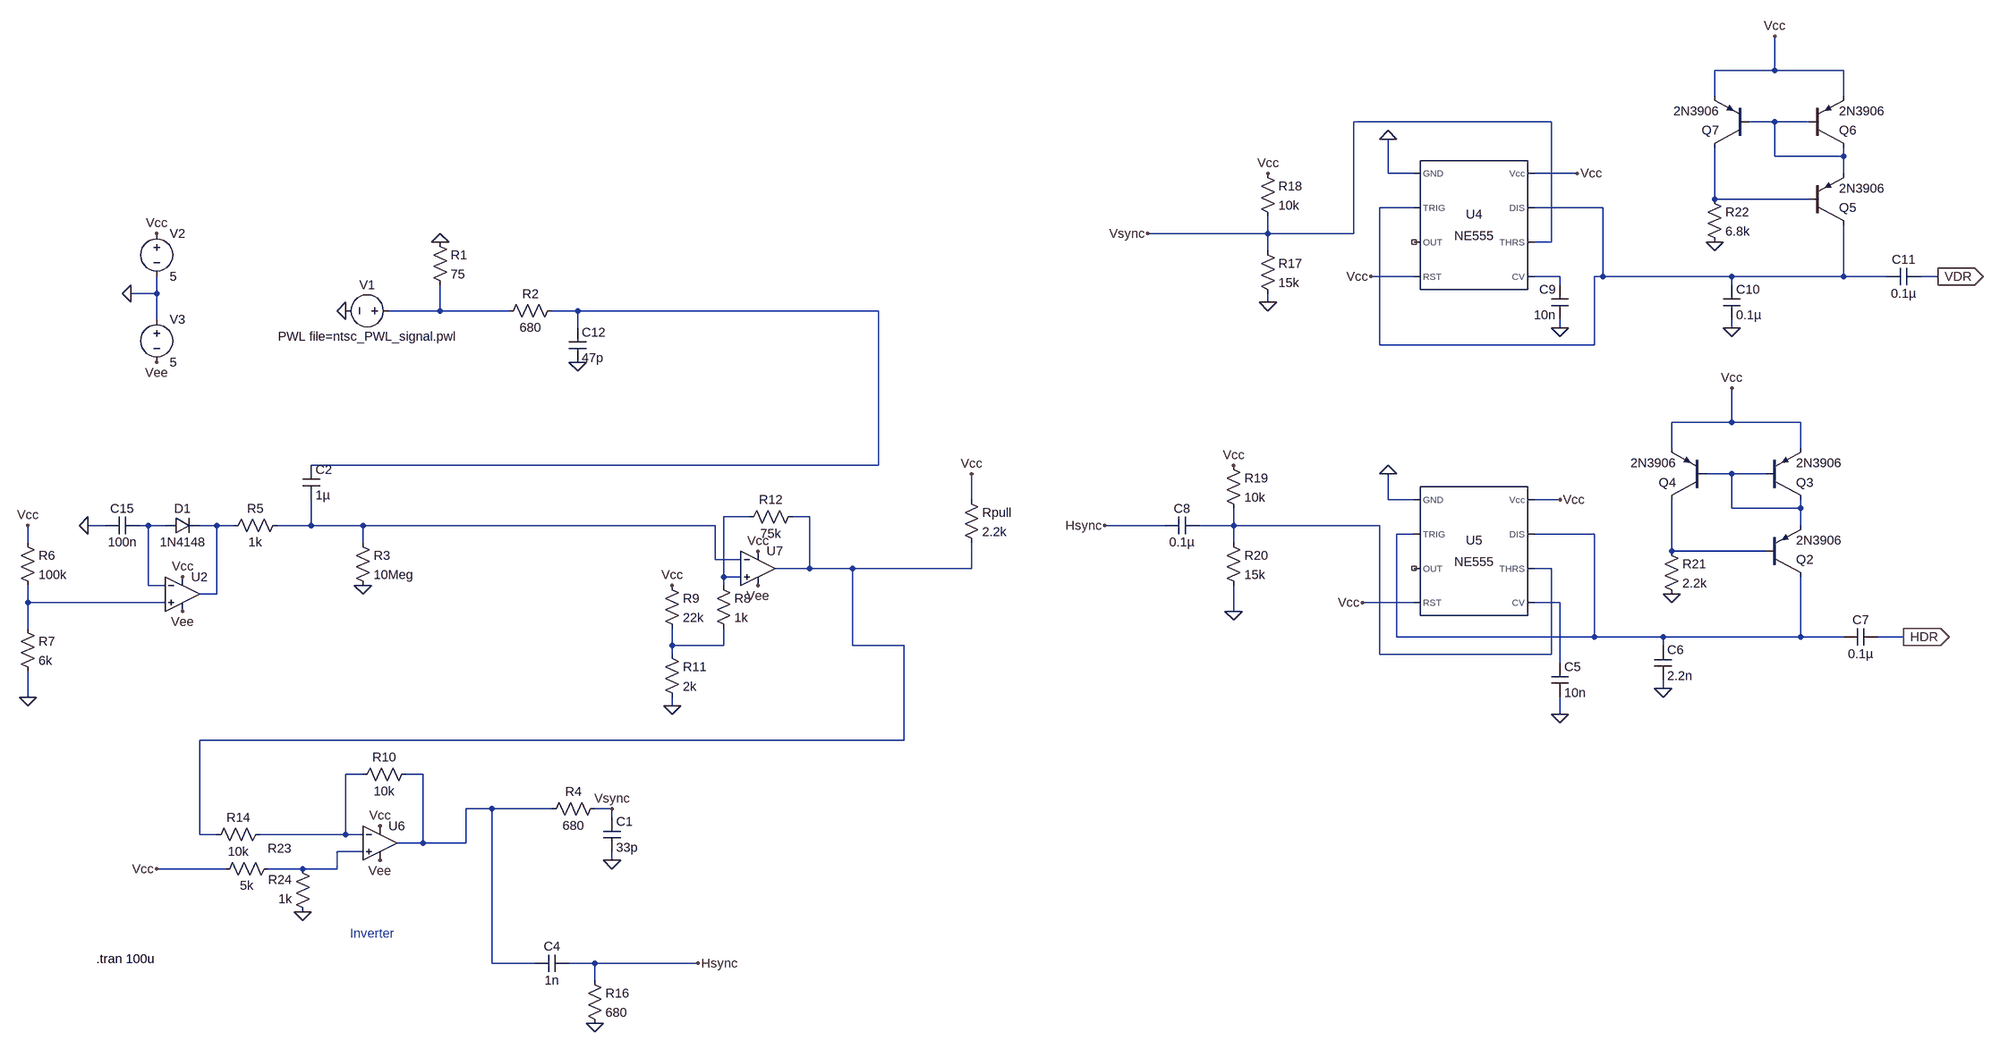
[diagram p0: schematic secondCircuit.asc]
secondCircuit.asc, the LTspice schematic file:
Version 4.1
SHEET 1 3116 1156
WIRE 2704 -640 2704 -704
WIRE 2704 -640 2592 -640
WIRE 2832 -640 2704 -640
WIRE 2592 -592 2592 -640
WIRE 2832 -592 2832 -640
WIRE 2288 -544 1920 -544
WIRE 2704 -544 2656 -544
WIRE 2768 -544 2704 -544
WIRE 2704 -480 2704 -544
WIRE 2832 -480 2832 -496
WIRE 2832 -480 2704 -480
WIRE 1984 -448 1984 -512
WIRE 2032 -448 1984 -448
WIRE 2336 -448 2256 -448
WIRE 2832 -448 2832 -480
WIRE 2592 -400 2592 -496
WIRE 2768 -400 2592 -400
WIRE 2032 -384 1968 -384
WIRE 2384 -384 2256 -384
WIRE 1760 -336 1760 -368
WIRE 1760 -336 1536 -336
WIRE 1920 -336 1920 -544
WIRE 1920 -336 1760 -336
WIRE 2288 -320 2288 -544
WIRE 2288 -320 2256 -320
WIRE 1760 -304 1760 -336
WIRE 2032 -256 1952 -256
WIRE 2304 -256 2256 -256
WIRE 2384 -256 2384 -384
WIRE 2384 -256 2368 -256
WIRE 2624 -256 2384 -256
WIRE 2832 -256 2832 -352
WIRE 2832 -256 2624 -256
WIRE 2912 -256 2832 -256
WIRE 3008 -256 2976 -256
WIRE 2304 -240 2304 -256
WIRE 2624 -240 2624 -256
WIRE -368 -224 -368 -256
WIRE -368 -224 -416 -224
WIRE 1760 -208 1760 -224
WIRE 160 -192 160 -240
WIRE 160 -192 64 -192
WIRE 288 -192 160 -192
WIRE 416 -192 368 -192
WIRE 976 -192 416 -192
WIRE -368 -176 -368 -224
WIRE 416 -160 416 -192
WIRE 2304 -160 2304 -176
WIRE 2624 -160 2624 -176
WIRE 1968 -128 1968 -384
WIRE 2368 -128 2368 -256
WIRE 2368 -128 1968 -128
WIRE 2624 16 2624 -48
WIRE 2624 16 2512 16
WIRE 2752 16 2624 16
WIRE 2512 64 2512 16
WIRE 2752 64 2752 16
WIRE 976 96 976 -192
WIRE 976 96 -80 96
WIRE 2624 112 2576 112
WIRE 2688 112 2624 112
WIRE 1168 160 1168 112
WIRE 1984 160 1984 112
WIRE 2032 160 1984 160
WIRE 2304 160 2256 160
WIRE 2624 176 2624 112
WIRE 2752 176 2752 160
WIRE 2752 176 2624 176
WIRE 736 192 688 192
WIRE 848 192 816 192
WIRE -464 208 -496 208
WIRE -384 208 -400 208
WIRE -352 208 -384 208
WIRE -256 208 -288 208
WIRE -224 208 -256 208
WIRE -80 208 -80 160
WIRE -80 208 -144 208
WIRE 16 208 -80 208
WIRE 672 208 16 208
WIRE 1568 208 1456 208
WIRE 1696 208 1696 176
WIRE 1696 208 1632 208
WIRE 1968 208 1696 208
WIRE 2752 208 2752 176
WIRE 2032 224 2000 224
WIRE 2368 224 2256 224
WIRE -608 240 -608 208
WIRE 16 240 16 208
WIRE 1696 240 1696 208
WIRE 2512 256 2512 160
WIRE 2688 256 2512 256
WIRE 672 272 672 208
WIRE 720 272 672 272
WIRE 848 288 848 192
WIRE 848 288 784 288
WIRE 928 288 848 288
WIRE 1168 288 1168 240
WIRE 1168 288 928 288
WIRE 2288 288 2256 288
WIRE 688 304 688 192
WIRE 720 304 688 304
WIRE -384 320 -384 208
WIRE -352 320 -384 320
WIRE 688 320 688 304
WIRE -256 336 -256 208
WIRE -256 336 -288 336
WIRE -608 352 -608 320
WIRE -352 352 -608 352
WIRE 2032 352 1936 352
WIRE 2304 352 2256 352
WIRE 1696 368 1696 320
WIRE -608 400 -608 352
WIRE 2000 416 2000 224
WIRE 2368 416 2368 224
WIRE 2368 416 2000 416
WIRE 2496 416 2368 416
WIRE 2752 416 2752 304
WIRE 2752 416 2496 416
WIRE 2832 416 2752 416
WIRE 2944 416 2896 416
WIRE 592 432 592 400
WIRE 688 432 688 400
WIRE 688 432 592 432
WIRE 928 432 928 288
WIRE 1024 432 928 432
WIRE 2496 432 2496 416
WIRE 592 448 592 432
WIRE 1968 448 1968 208
WIRE 2288 448 2288 288
WIRE 2288 448 1968 448
WIRE 2304 464 2304 352
WIRE 2496 512 2496 496
WIRE -608 528 -608 480
WIRE 592 544 592 528
WIRE 2304 560 2304 528
WIRE 1024 608 1024 432
WIRE 1024 608 -288 608
WIRE 16 672 -16 672
WIRE 128 672 96 672
WIRE 256 736 208 736
WIRE 368 736 256 736
WIRE 480 736 448 736
WIRE 480 752 480 736
WIRE -288 784 -288 608
WIRE -256 784 -288 784
WIRE -16 784 -16 672
WIRE -16 784 -176 784
WIRE 16 784 -16 784
WIRE 128 800 128 672
WIRE 128 800 80 800
WIRE 208 800 208 736
WIRE 208 800 128 800
WIRE 16 816 -32 816
WIRE 480 832 480 816
WIRE -240 848 -368 848
WIRE -96 848 -160 848
WIRE -32 848 -32 816
WIRE -32 848 -96 848
WIRE 256 1024 256 736
WIRE 336 1024 256 1024
WIRE 448 1024 400 1024
WIRE 640 1024 448 1024
WIRE 448 1056 448 1024
FLAG -16 -192 0
FLAG 160 -320 0
FLAG 448 1136 0
FLAG 640 1024 Hsync
FLAG 1760 -208 0
FLAG 1760 -448 Vcc
FLAG 1696 96 Vcc
FLAG 1696 368 0
FLAG 1984 112 0
FLAG 2304 560 0
FLAG 2496 512 0
FLAG 2512 336 0
FLAG 2944 416 HDR
IOPIN 2944 416 Out
FLAG 2336 -448 Vcc
FLAG 1984 -512 0
FLAG 2304 -160 0
FLAG 1952 -256 Vcc
FLAG 2592 -320 0
FLAG 2704 -704 Vcc
FLAG 2624 -160 0
FLAG 3008 -256 VDR
IOPIN 3008 -256 Out
FLAG 48 768 Vcc
FLAG -368 848 Vcc
FLAG -96 928 0
FLAG 1536 -336 Vsync
FLAG 1456 208 Hsync
FLAG 416 -96 0
FLAG -496 208 0
FLAG -320 368 Vee
FLAG -320 304 Vcc
FLAG -608 208 Vcc
FLAG -608 528 0
FLAG 592 544 0
FLAG 592 320 Vcc
FLAG 752 256 Vcc
FLAG -368 -336 Vcc
FLAG -368 -96 Vee
FLAG -416 -224 0
FLAG 2304 160 Vcc
FLAG 2624 -48 Vcc
FLAG 1936 352 Vcc
FLAG 1168 112 Vcc
FLAG 16 320 0
FLAG 48 832 Vee
FLAG 752 320 Vee
FLAG 480 832 0
FLAG 480 736 Vsync
SYMBOL voltage 80 -192 R90
WINDOW 0 -32 56 VBottom 2
WINDOW 3 32 56 VTop 2
WINDOW 123 0 0 Left 0
WINDOW 39 0 0 Left 0
SYMATTR InstName V1
SYMATTR Value PWL file=ntsc_PWL_signal.pwl
SYMBOL res 144 -336 R0
SYMATTR InstName R1
SYMATTR Value 75
SYMBOL res -160 768 R90
WINDOW 0 0 56 VBottom 2
WINDOW 3 32 56 VTop 2
SYMATTR InstName R14
SYMATTR Value 10k
SYMBOL cap 400 1008 R90
WINDOW 0 0 32 VBottom 2
WINDOW 3 32 32 VTop 2
SYMATTR InstName C4
SYMATTR Value 1n
SYMBOL res 432 1040 R0
SYMATTR InstName R16
SYMATTR Value 680
SYMBOL res 1744 -320 R0
SYMATTR InstName R17
SYMATTR Value 15k
SYMBOL res 1744 -464 R0
SYMATTR InstName R18
SYMATTR Value 10k
SYMBOL Misc\\NE555 2144 -352 R0
SYMATTR InstName U4
SYMBOL Misc\\NE555 2144 256 R0
SYMATTR InstName U5
SYMBOL res 1680 80 R0
SYMATTR InstName R19
SYMATTR Value 10k
SYMBOL res 1680 224 R0
SYMATTR InstName R20
SYMATTR Value 15k
SYMBOL cap 2288 464 R0
SYMATTR InstName C5
SYMATTR Value 10n
SYMBOL cap 2480 432 R0
SYMATTR InstName C6
SYMATTR Value 2.2n
SYMBOL cap 2896 400 R90
WINDOW 0 0 32 VBottom 2
WINDOW 3 32 32 VTop 2
SYMATTR InstName C7
SYMATTR Value 0.1µ
SYMBOL pnp 2688 304 M180
SYMATTR InstName Q2
SYMATTR Value 2N3906
SYMBOL pnp 2688 160 M180
SYMATTR InstName Q3
SYMATTR Value 2N3906
SYMBOL pnp 2576 160 R180
SYMATTR InstName Q4
SYMATTR Value 2N3906
SYMBOL res 2496 240 R0
SYMATTR InstName R21
SYMATTR Value 2.2k
SYMBOL cap 1632 192 R90
WINDOW 0 0 32 VBottom 2
WINDOW 3 32 32 VTop 2
SYMATTR InstName C8
SYMATTR Value 0.1µ
SYMBOL cap 2320 -176 R180
WINDOW 0 24 56 Left 2
WINDOW 3 24 8 Left 2
SYMATTR InstName C9
SYMATTR Value 10n
SYMBOL pnp 2768 -352 M180
SYMATTR InstName Q5
SYMATTR Value 2N3906
SYMBOL pnp 2768 -496 M180
SYMATTR InstName Q6
SYMATTR Value 2N3906
SYMBOL pnp 2656 -496 R180
SYMATTR InstName Q7
SYMATTR Value 2N3906
SYMBOL res 2576 -416 R0
SYMATTR InstName R22
SYMATTR Value 6.8k
SYMBOL cap 2608 -240 R0
SYMATTR InstName C10
SYMATTR Value 0.1µ
SYMBOL cap 2976 -272 R90
WINDOW 0 0 32 VBottom 2
WINDOW 3 32 32 VTop 2
SYMATTR InstName C11
SYMATTR Value 0.1µ
SYMBOL OpAmps\\UniversalOpAmp2 48 800 R0
SYMATTR InstName U6
SYMBOL res -144 832 R90
WINDOW 0 -6 -5 VBottom 2
WINDOW 3 32 56 VTop 2
SYMATTR InstName R23
SYMATTR Value 5k
SYMBOL res -80 944 R180
WINDOW 0 36 76 Left 2
WINDOW 3 36 40 Left 2
SYMATTR InstName R24
SYMATTR Value 1k
SYMBOL res 112 656 R90
WINDOW 0 0 56 VBottom 2
WINDOW 3 32 56 VTop 2
SYMATTR InstName R10
SYMATTR Value 10k
SYMBOL res 384 -208 R90
WINDOW 0 0 56 VBottom 2
WINDOW 3 32 56 VTop 2
SYMATTR InstName R2
SYMATTR Value 680
SYMBOL cap 400 -160 R0
SYMATTR InstName C12
SYMATTR Value 47p
SYMBOL cap -96 96 R0
SYMATTR InstName C2
SYMATTR Value 1µ
SYMBOL res -128 192 R90
WINDOW 0 0 56 VBottom 2
WINDOW 3 32 56 VTop 2
SYMATTR InstName R5
SYMATTR Value 1k
SYMBOL diode -352 224 R270
WINDOW 0 32 32 VTop 2
WINDOW 3 0 32 VBottom 2
SYMATTR InstName D1
SYMATTR Value 1N4148
SYMBOL cap -400 192 R90
WINDOW 0 0 32 VBottom 2
WINDOW 3 32 32 VTop 2
SYMATTR InstName C15
SYMATTR Value 100n
SYMBOL OpAmps\\UniversalOpAmp2 -320 336 R0
SYMATTR InstName U2
SYMBOL res -624 224 R0
SYMATTR InstName R6
SYMATTR Value 100k
SYMBOL res -624 384 R0
SYMATTR InstName R7
SYMATTR Value 6k
SYMBOL OpAmps\\UniversalOpAmp2 752 288 R0
SYMATTR InstName U7
SYMBOL res 672 304 R0
SYMATTR InstName R8
SYMATTR Value 1k
SYMBOL res 576 304 R0
SYMATTR InstName R9
SYMATTR Value 22k
SYMBOL res 576 432 R0
SYMATTR InstName R11
SYMATTR Value 2k
SYMBOL res 832 176 R90
WINDOW 0 0 56 VBottom 2
WINDOW 3 32 56 VTop 2
SYMATTR InstName R12
SYMATTR Value 75k
SYMBOL res 1152 144 R0
SYMATTR InstName Rpull
SYMATTR Value 2.2k
SYMBOL voltage -368 -352 R0
SYMATTR InstName V2
SYMATTR Value 5
SYMBOL voltage -368 -192 R0
SYMATTR InstName V3
SYMATTR Value 5
SYMBOL res 0 224 R0
SYMATTR InstName R3
SYMATTR Value 10Meg
SYMBOL res 464 720 R90
WINDOW 0 0 56 VBottom 2
WINDOW 3 32 56 VTop 2
SYMATTR InstName R4
SYMATTR Value 680
SYMBOL cap 464 752 R0
SYMATTR InstName C1
SYMATTR Value 33p
TEXT -480 1016 Left 2 !.tran 100u
TEXT -8 968 Left 2 ;Inverter

The netlist it stands for:
* secondCircuit.asc
V1 N005 0 PWL file=ntsc_PWL_signal.pwl
R1 0 N005 75
R14 N019 N009 10k
C4 Hsync N020 1n
R16 Hsync 0 680
R17 Vsync 0 15k
R18 Vcc Vsync 10k
X§U4 0 N003 NC_01 Vcc N004 Vsync N003 Vcc NE555  ; pins GND TRIG OUT RST CV THRS DIS Vcc
X§U5 0 N014 NC_02 Vcc N017 N013 N014 Vcc NE555  ; pins GND TRIG OUT RST CV THRS DIS Vcc
R19 Vcc N013 10k
R20 N013 0 15k
C5 N017 0 10n
C6 N014 0 2.2n
C7 HDR N014 0.1µ
Q2 N014 N015 N007 0 2N3906
Q3 N007 N007 Vcc 0 2N3906
Q4 N015 N007 Vcc 0 2N3906
R21 N015 0 2.2k
C8 N013 Hsync 0.1µ
C9 0 N004 10n
Q5 N003 N002 N001 0 2N3906
Q6 N001 N001 Vcc 0 2N3906
Q7 N002 N001 Vcc 0 2N3906
R22 N002 0 6.8k
C10 N003 0 0.1µ
C11 VDR N003 0.1µ
X§U6 N021 N019 Vcc Vee N020 level2 Avol=1Meg GBW=10Meg Slew=10Meg Ilimit=25m Rail=0 Vos=0 En=0 Enk=0 In=0 Ink=0 Rin=500Meg  ; pins In+ In- V+ V- OUT
R23 N021 Vcc 5k
R24 0 N021 1k
R10 N020 N019 10k
R2 N006 N005 680
C12 N006 0 47p
C2 N006 N012 1µ
R5 N012 N011 1k
D1 N010 N011 1N4148
C15 N010 0 100n
X§U2 N016 N010 Vcc Vee N011 level2 Avol=1Meg GBW=10Meg Slew=10Meg Ilimit=25m Rail=0 Vos=0 En=0 Enk=0 In=0 Ink=0 Rin=500Meg  ; pins In+ In- V+ V- OUT
R6 Vcc N016 100k
R7 N016 0 6k
X§U7 N008 N012 Vcc Vee N009 level2 Avol=1Meg GBW=10Meg Slew=10Meg Ilimit=25m Rail=0 Vos=0 En=0 Enk=0 In=0 Ink=0 Rin=500Meg  ; pins In+ In- V+ V- OUT
R8 N008 N018 1k
R9 Vcc N018 22k
R11 N018 0 2k
R12 N009 N008 75k
Rpull Vcc N009 2.2k
V2 Vcc 0 5
V3 0 Vee 5
R3 N012 0 10Meg
R4 Vsync N020 680
C1 Vsync 0 33p
.model D D
.lib standard.dio
.model NPN NPN
.model PNP PNP
.lib standard.bjt
.tran 100u
* Inverter
.lib NE555.sub
.lib UniversalOpAmp2.lib
.backanno
.end